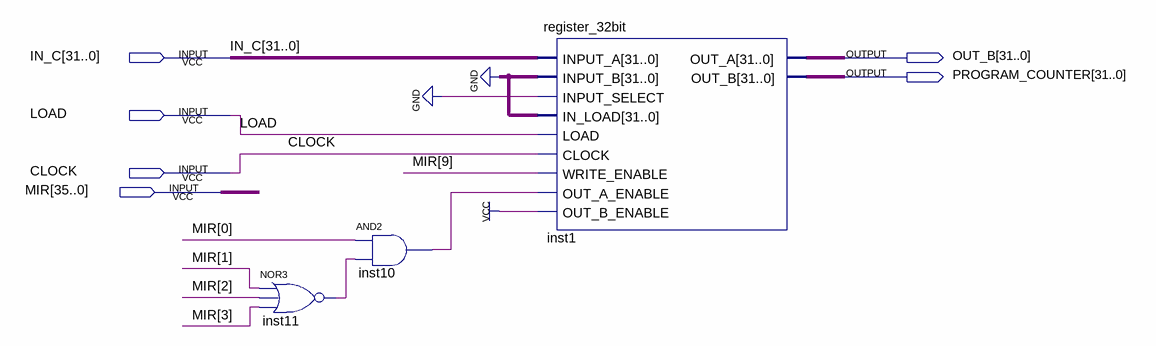
[diagram p0: schematic sheet]
// Quartus schematic PC.bdf as structural Verilog: 3 symbols, 6 pins
module PC (
  input  [31:0] IN_C,
  input  LOAD,
  input  CLOCK,
  input  [35:0] MIR,
  output [31:0] OUT_B,
  output [31:0] PROGRAM_COUNTER
);

  wire inst10_out, inst11_out;

  nor inst11 (inst11_out, MIR[1], MIR[2], MIR[3]);
  and inst10 (inst10_out, MIR[0], inst11_out);
  register_32bit inst1 (
    .INPUT_A(IN_C), .INPUT_B({32{1'b0}}), .INPUT_SELECT(1'b0), .IN_LOAD({32{1'b0}}), .LOAD(LOAD),
    .CLOCK(CLOCK), .WRITE_ENABLE(MIR[9]), .OUT_A_ENABLE(inst10_out), .OUT_B_ENABLE(1'b1), .OUT_A(OUT_B),
    .OUT_B(PROGRAM_COUNTER));
endmodule
